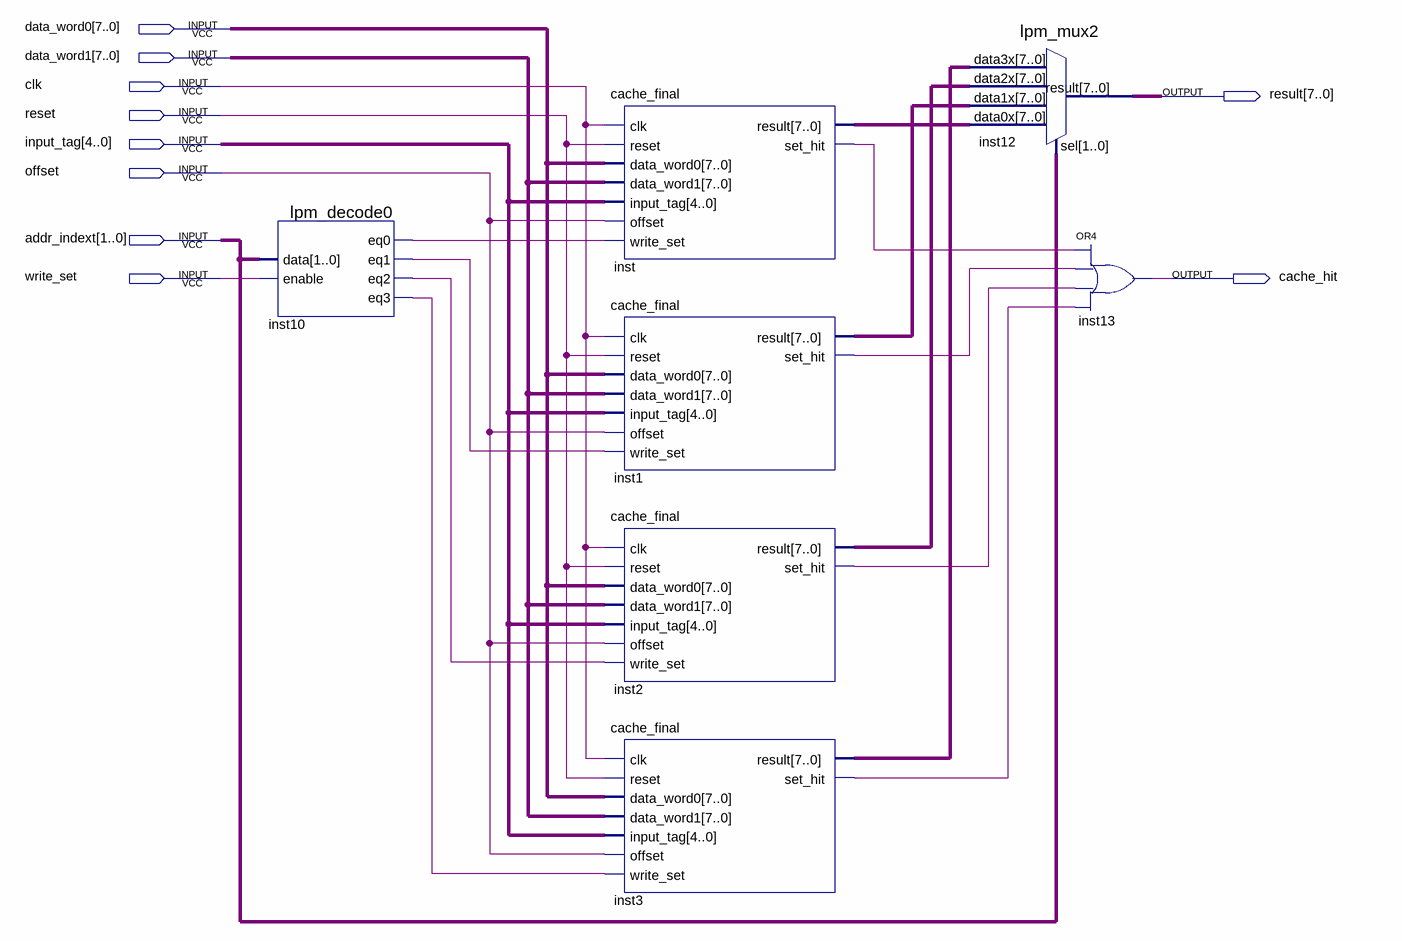
[diagram p0: schematic sheet]
// Quartus schematic laba8_var1.bdf as structural Verilog: 7 symbols, 10 pins
module laba8_var1 (
  input  [7:0] data_word0,
  input  [7:0] data_word1,
  input  clk,
  input  reset,
  input  [4:0] input_tag,
  input  offset,
  input  [1:0] addr_indext,
  input  write_set,
  output [7:0] result,
  output cache_hit
);

  wire inst1_set_hit, inst2_set_hit, inst3_set_hit, inst10_eq0, inst10_eq1, inst10_eq2, inst10_eq3,
       inst_set_hit;
  wire [7:0] inst1_result, inst2_result, inst3_result, inst_result;

  lpm_decode0 inst10 (
    .data(addr_indext), .enable(write_set), .eq0(inst10_eq0), .eq1(inst10_eq1), .eq2(inst10_eq2),
    .eq3(inst10_eq3));
  cache_final inst (
    .clk(clk), .reset(reset), .data_word0(data_word0), .data_word1(data_word1), .input_tag(input_tag),
    .offset(offset), .write_set(inst10_eq0), .result(inst_result), .set_hit(inst_set_hit));
  cache_final inst1 (
    .clk(clk), .reset(reset), .data_word0(data_word0), .data_word1(data_word1), .input_tag(input_tag),
    .offset(offset), .write_set(inst10_eq1), .result(inst1_result), .set_hit(inst1_set_hit));
  cache_final inst2 (
    .clk(clk), .reset(reset), .data_word0(data_word0), .data_word1(data_word1), .input_tag(input_tag),
    .offset(offset), .write_set(inst10_eq2), .result(inst2_result), .set_hit(inst2_set_hit));
  cache_final inst3 (
    .clk(clk), .reset(reset), .data_word0(data_word0), .data_word1(data_word1), .input_tag(input_tag),
    .offset(offset), .write_set(inst10_eq3), .result(inst3_result), .set_hit(inst3_set_hit));
  lpm_mux2 inst12 (
    .data3x(inst3_result), .data2x(inst2_result), .data1x(inst1_result), .data0x(inst_result),
    .sel(addr_indext), .result(result));
  or inst13 (cache_hit, inst_set_hit, inst1_set_hit, inst2_set_hit, inst3_set_hit);
endmodule
